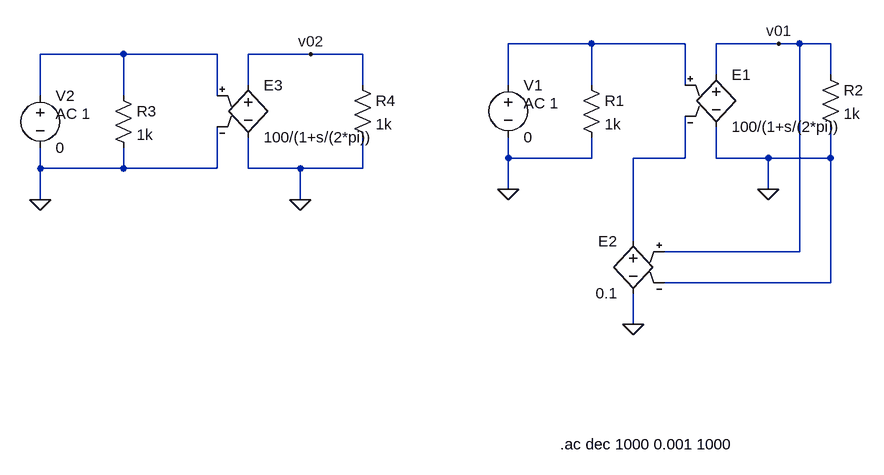
[diagram p0: schematic Realimentacio-laplace.asc]
Realimentacio-laplace.asc, the LTspice schematic file:
Version 4
SHEET 1 880 680
WIRE -128 -160 -256 -160
WIRE 16 -160 -128 -160
WIRE 160 -160 64 -160
WIRE 192 -160 160 -160
WIRE 240 -160 192 -160
WIRE -848 -144 -976 -144
WIRE -704 -144 -848 -144
WIRE -560 -144 -656 -144
WIRE -480 -144 -560 -144
WIRE 64 -112 64 -160
WIRE 240 -112 240 -160
WIRE -656 -96 -656 -144
WIRE -480 -96 -480 -144
WIRE -256 -96 -256 -160
WIRE -128 -96 -128 -160
WIRE 16 -96 16 -160
WIRE -976 -80 -976 -144
WIRE -848 -80 -848 -144
WIRE -704 -80 -704 -144
WIRE -256 16 -256 -16
WIRE -128 16 -128 -16
WIRE -128 16 -256 16
WIRE 16 16 16 -48
WIRE 16 16 -64 16
WIRE 64 16 64 -32
WIRE 144 16 64 16
WIRE 240 16 240 -32
WIRE 240 16 144 16
WIRE -976 32 -976 0
WIRE -848 32 -848 0
WIRE -848 32 -976 32
WIRE -704 32 -704 -32
WIRE -704 32 -848 32
WIRE -656 32 -656 -16
WIRE -576 32 -656 32
WIRE -480 32 -480 -16
WIRE -480 32 -576 32
WIRE -256 64 -256 16
WIRE 144 64 144 16
WIRE -976 80 -976 32
WIRE -576 80 -576 32
WIRE -64 144 -64 16
WIRE 192 160 192 -160
WIRE 192 160 -16 160
WIRE 240 208 240 16
WIRE 240 208 -16 208
WIRE -64 272 -64 224
FLAG -64 272 0
FLAG -256 64 0
FLAG 144 64 0
FLAG 160 -160 v01
FLAG -976 80 0
FLAG -576 80 0
FLAG -560 -144 v02
SYMBOL e 64 -128 R0
SYMATTR InstName E1
SYMATTR Value 100/(1+s/(2*pi))
SYMATTR SpiceModel laplace
SYMBOL e -64 128 M0
SYMATTR InstName E2
SYMATTR Value 0.1
SYMBOL res -144 -112 R0
SYMATTR InstName R1
SYMATTR Value 1k
SYMBOL res 224 -128 R0
SYMATTR InstName R2
SYMATTR Value 1k
SYMBOL voltage -256 -112 R0
WINDOW 123 24 44 Left 2
WINDOW 39 0 0 Left 0
SYMATTR Value2 AC 1
SYMATTR InstName V1
SYMATTR Value 0
SYMBOL e -656 -112 R0
SYMATTR InstName E3
SYMATTR Value 100/(1+s/(2*pi))
SYMATTR SpiceModel laplace
SYMBOL res -864 -96 R0
SYMATTR InstName R3
SYMATTR Value 1k
SYMBOL res -496 -112 R0
SYMATTR InstName R4
SYMATTR Value 1k
SYMBOL voltage -976 -96 R0
WINDOW 123 24 44 Left 2
WINDOW 39 0 0 Left 0
SYMATTR Value2 AC 1
SYMATTR InstName V2
SYMATTR Value 0
TEXT -176 456 Left 2 !.ac dec 1000 0.001 1000

The netlist it stands for:
* Realimentacio-laplace.asc
E1 v01 0 N001 N003 laplace 100/(1+s/(2*pi))
E2 N003 0 v01 0 0.1
R1 N001 0 1k
R2 v01 0 1k
V1 N001 0 0 AC 1
E3 v02 0 N002 0 laplace 100/(1+s/(2*pi))
R3 N002 0 1k
R4 v02 0 1k
V2 N002 0 0 AC 1
.ac dec 1000 0.001 1000
.backanno
.end